# EAGLE design vectrex (EAGLE 6.6.0)
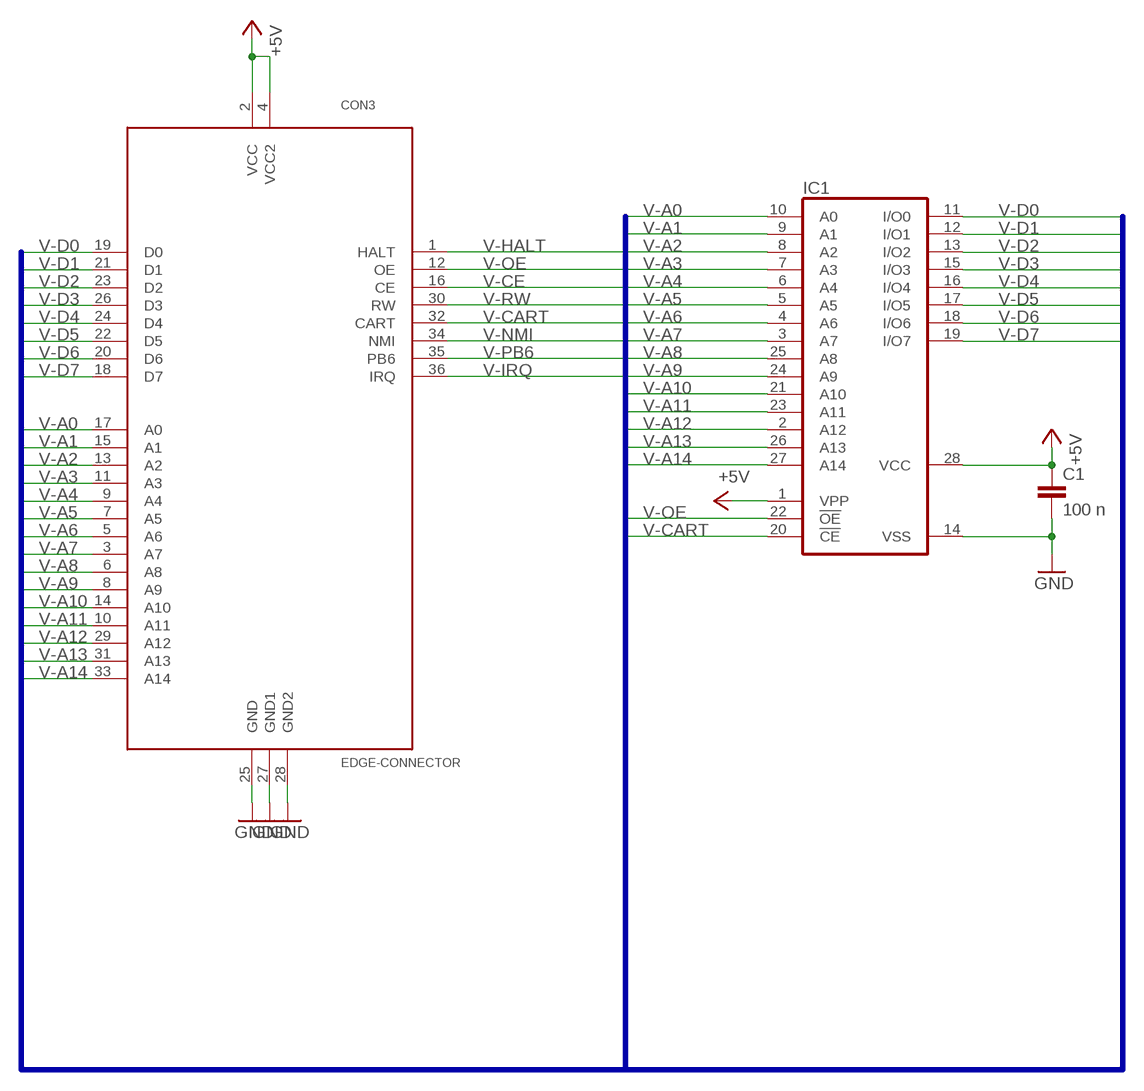
[diagram p0: schematic, sheet 1]

## Parts
C1  100 n  C-EU050-045X075  [C050-045X075]
CON3  EDGE-CONNECTOR  [EDGE-CONNECTOR]
IC1  27C256AG  [DIL28-6]

## Nets
+5V: C1.1 CON3.2(VCC) CON3.4(VCC2) IC1.1(VPP) IC1.28(VCC)
GND: C1.2 CON3.25(GND) CON3.27(GND1) CON3.28(GND2) IC1.14(VSS)
V-A0: CON3.17(A0) IC1.10(A0)
V-A1: CON3.15(A1) IC1.9(A1)
V-A2: CON3.13(A2) IC1.8(A2)
V-A3: CON3.11(A3) IC1.7(A3)
V-A4: CON3.9(A4) IC1.6(A4)
V-A5: CON3.7(A5) IC1.5(A5)
V-A6: CON3.5(A6) IC1.4(A6)
V-A7: CON3.3(A7) IC1.3(A7)
V-A8: CON3.6(A8) IC1.25(A8)
V-A9: CON3.8(A9) IC1.24(A9)
V-A10: CON3.14(A10) IC1.21(A10)
V-A11: CON3.10(A11) IC1.23(A11)
V-A12: CON3.29(A12) IC1.2(A12)
V-A13: CON3.31(A13) IC1.26(A13)
V-A14: CON3.33(A14) IC1.27(A14)
V-CART: CON3.32(CART) IC1.20(!CE)
V-CE: CON3.16(CE)
V-D0: CON3.19(D0) IC1.11(I/O0)
V-D1: CON3.21(D1) IC1.12(I/O1)
V-D2: CON3.23(D2) IC1.13(I/O2)
V-D3: CON3.26(D3) IC1.15(I/O3)
V-D4: CON3.24(D4) IC1.16(I/O4)
V-D5: CON3.22(D5) IC1.17(I/O5)
V-D6: CON3.20(D6) IC1.18(I/O6)
V-D7: CON3.18(D7) IC1.19(I/O7)
V-HALT: CON3.1(HALT)
V-IRQ: CON3.36(IRQ)
V-NMI: CON3.34(NMI)
V-OE: CON3.12(OE) IC1.22(!OE)
V-PB6: CON3.35(PB6)
V-RW: CON3.30(RW)

## Buses
V-DIR[0..6],V-A[0..14],V-D[0..7],V-HALT,V-OE,V-CE,V-RW,V-CART,V-NMI,V-PB6,V-IRQ

## Library data of the parts
C1 = rcl:C-EU: CAPACITOR, European symbol
CON3 = vectrex-cartridge:EDGE-CONNECTOR
IC1 = memory-hitachi:27C256AG: MEMORY; OC_FARNELL: unknown; OC_NEWARK: unknown

## Board
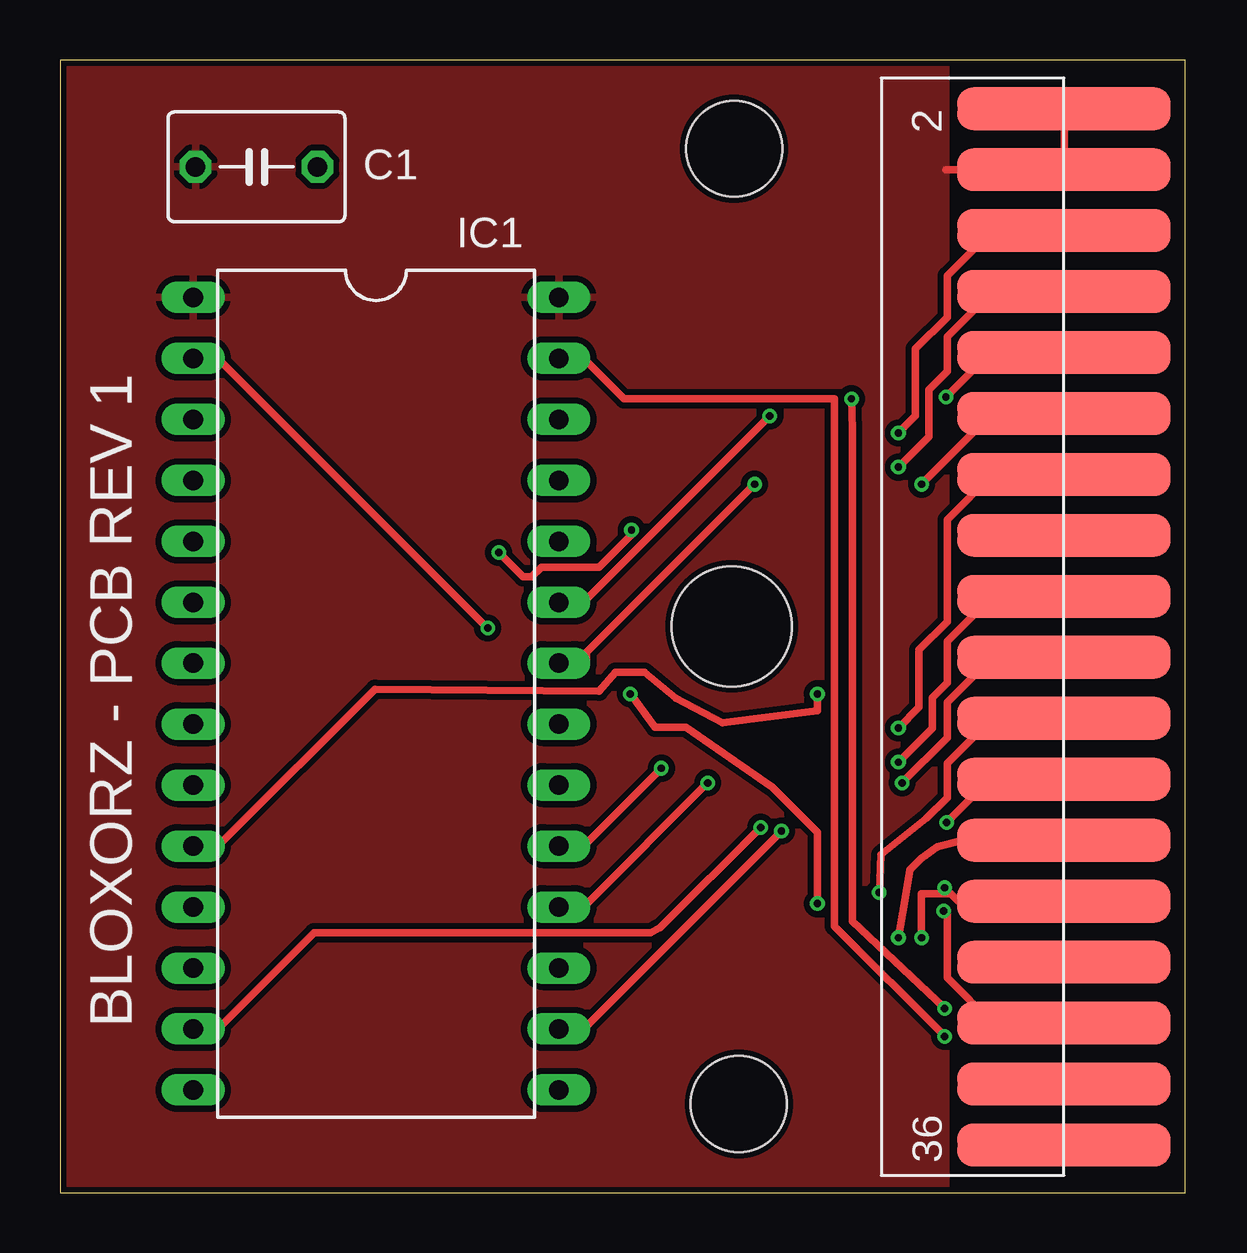
[diagram p1: board, top side]
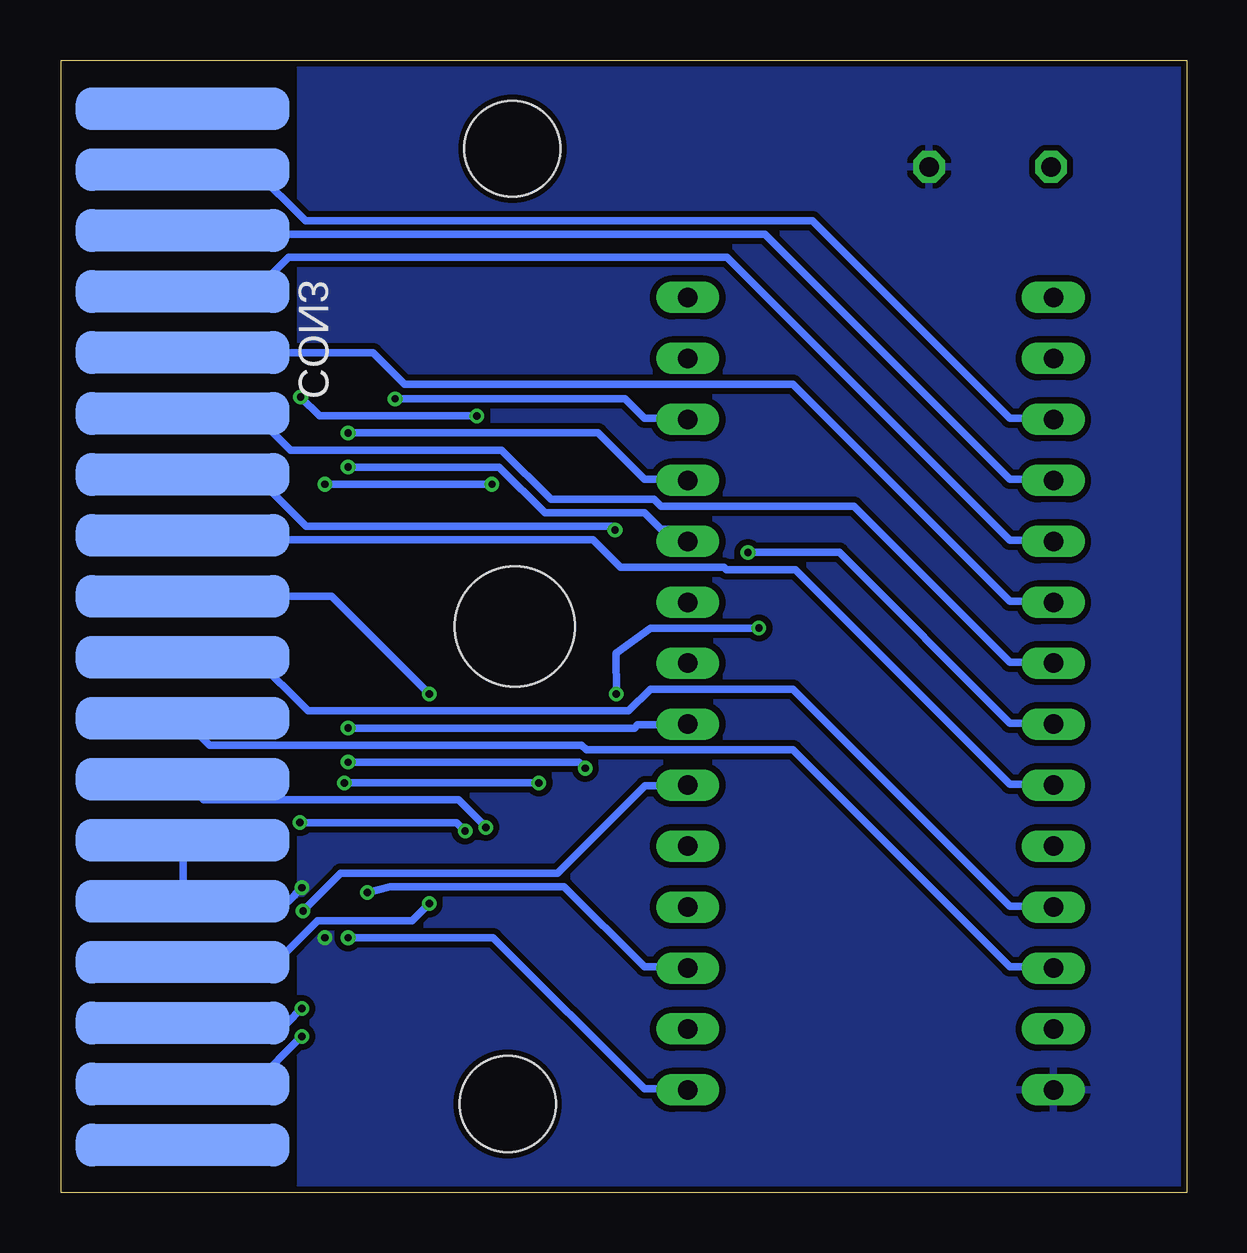
[diagram p2: board, bottom side, seen from below]

Size 46.9 x 47.2 mm. Coordinates in mm from the lower left corner, seen from the top.
Outline: 0,0 46.9,0 46.9,47.2 0,47.2 0,0
Copper layers (1*16): Top 0.035mm / dielectric 1.5mm / Bottom 0.035mm
Design rules "ITead_rule *": minimum track width 12mil, minimum drill 12mil, track to track 10mil, track to pad 10mil, pad to pad 10mil, via to via 10mil, smd to smd 0mil, copper to edge 10mil, drill to drill 10mil, minimum pad ring 10mil, minimum via ring 6mil, stop-mask expansion 2mil, vias tented up to drill 100mil, thermal gap 10mil
Holes 5 mm at 28,23.6
Holes 4 mm at 28.1,43.5 28.3,3.7

### Footprints (pad centres in the part's own frame; a part is rotated, then mirrored left to right if it is on the bottom)
C050-045X075 = drill 0.813 octagon: 1 -2.54,0; 2 2.54,0
EDGE-CONNECTOR = smd 1.778 x 8.89 bottom: 1 -25.4,0; 3 -22.86,0; 5 -20.32,0; 7 -17.78,0; 9 -15.24,0; 11 -12.7,0; 13 -10.16,0; 15 -7.62,0; 17 -5.08,0; 19 -2.54,0; 21 0,0; 23 2.54,0; 25 5.08,0; 27 7.62,0; 29 10.16,0; 31 12.7,0; 33 15.24,0; 35 17.78,0 | smd 1.778 x 8.89: 2 -25.4,0; 4 -22.86,0; 6 -20.32,0; 8 -17.78,0; 10 -15.24,0; 12 -12.7,0; 14 -10.16,0; 16 -7.62,0; 18 -5.08,0; 20 -2.54,0; 22 0,0; 24 2.54,0; 26 5.08,0; 28 7.62,0; 30 10.16,0; 32 12.7,0; 34 15.24,0; 36 17.78,0
DIL28-6 = drill 0.813 long: 1 -16.51,-7.62; 2 -13.97,-7.62; 3 -11.43,-7.62; 4 -8.89,-7.62; 5 -6.35,-7.62; 6 -3.81,-7.62; 7 -1.27,-7.62; 8 1.27,-7.62; 9 3.81,-7.62; 10 6.35,-7.62; 11 8.89,-7.62; 12 11.43,-7.62; 13 13.97,-7.62; 14 16.51,-7.62; 15 16.51,7.62; 16 13.97,7.62; 17 11.43,7.62; 18 8.89,7.62; 19 6.35,7.62; 20 3.81,7.62; 21 1.27,7.62; 22 -1.27,7.62; 23 -3.81,7.62; 24 -6.35,7.62; 25 -8.89,7.62; 26 -11.43,7.62; 27 -13.97,7.62; 28 -16.51,7.62

### Placement (x,y rotation side)
C1  8.19,42.75 0 top
CON3  41.85,19.77 270 top
IC1  13.17,20.8 270 top

### Tracks (layer width: path | path; a pad name or v marks a point on that pad's centre or on a via)
+5V
  Top 0.305: CON3.2 CON3.4 36.93,42.63
  pour Top: 0,0 0,47.2 36.93,47.2 36.93,-0.04
GND  (via drill 0.3)
  Top 0.305: CON3.28 37.44,12.15 37.13,12.46 36.88,12.46 | 36.88,12.46 35.91,12.46 v35.91,10.63 | v36.88,12.71 36.88,12.46
  Bottom 0.305: v36.88,12.71 37.44,12.15 CON3.28 41.83,12.28 41.83,14.69 CON3.25
  pour Bottom: 0,0 0,47.2 36.93,47.2 36.93,-0.04
V-A0  (via drill 0.3)
  Top 0.305: v31.57,20.79 31.57,20.08 27.61,19.58 25.68,20.6 24.37,21.7 23.16,21.69 22.46,20.89 13.13,20.99 6.7,14.57 6.7,14.46 5.56,14.46 IC1.10
  Bottom 0.305: v31.57,20.79 35.64,24.85 CON3.17
V-A1
  Bottom 0.305: IC1.9 5.56,17 5.59,17.03 7.36,17.03 16.3,25.97 19.17,25.97 19.28,26.07 23.59,26.07 24.74,27.21 41.65,27.21 41.83,27.39 CON3.15
V-A2  (via drill 0.3)
  Top 0.305: v18.29,26.68 19.3,25.67 19.66,25.67 20.06,26.07 22.48,26.07 23.82,27.42 v23.82,27.62
  Bottom 0.305: v18.29,26.68 14.48,26.68 7.36,19.57 5.59,19.57 5.56,19.54 IC1.8 | v23.82,27.62 23.98,27.77 36.7,27.77 38.86,29.93 CON3.13
V-A3
  Bottom 0.305: CON3.11 38.86,32.47 37.34,30.95 28.55,30.95 26.49,28.89 22.2,28.89 21.92,28.61 13.87,28.61 7.36,22.11 5.59,22.11 5.56,22.08 IC1.7
V-A4
  Bottom 0.305: CON3.9 33.91,35.01 32.59,33.69 16.41,33.69 7.36,24.65 5.59,24.65 5.56,24.62 IC1.6
V-A5
  Bottom 0.305: CON3.7 38.86,37.55 37.44,38.97 19.15,38.97 7.36,27.19 5.59,27.19 5.56,27.16 IC1.5
V-A6
  Bottom 0.305: IC1.4 5.56,29.7 5.59,29.73 7.36,29.73 17.58,39.94 41.68,39.94 41.83,40.09 CON3.5
V-A7
  Bottom 0.305: CON3.3 38.86,42.63 36.73,40.5 15.59,40.5 7.36,32.27 5.59,32.27 5.56,32.24 IC1.3
V-A8  (via drill 0.3)
  Top 0.305: v34.95,31.66 35.66,32.37 35.66,35.16 36.98,36.48 36.98,38.21 38.86,40.09 CON3.6
  Bottom 0.305: v34.95,31.66 24.53,31.66 22.6,29.73 20.83,29.73 20.8,29.7 IC1.25
V-A9  (via drill 0.3)
  Top 0.305: v34.95,30.24 36.22,31.51 36.22,33.46 36.98,34.22 36.98,35.67 38.86,37.55 CON3.8
  Bottom 0.305: v34.95,30.24 28.65,30.24 26.75,28.33 22.6,28.33 21.92,27.65 21.28,27.65 20.8,27.16 IC1.24
V-A10  (via drill 0.3)
  Top 0.305: v34.95,19.37 35.81,20.23 35.81,22.62 36.98,23.79 36.98,28.05 38.86,29.93 CON3.14
  Bottom 0.305: v34.95,19.37 23.01,19.37 22.88,19.49 20.83,19.49 20.8,19.52 IC1.21
V-A11  (via drill 0.3)
  Top 0.305: v29.59,32.37 21.94,24.72 21.94,24.62 20.8,24.62 IC1.23 | v36.93,33.16 38.78,35.01 CON3.10
  Bottom 0.305: v29.59,32.37 36.14,32.37 v36.93,33.16
V-A12  (via drill 0.3)
  Top 0.305: v17.83,23.53 6.7,34.66 6.7,34.76 5.56,34.76 IC1.2 | v23.77,20.79 24.01,20.49 24.8,19.4 26.1,19.4 29.7,16.9 31.57,15.03 v31.57,12.05
  Bottom 0.305: v17.83,23.53 22.35,23.53 23.79,22.49 v23.77,20.79 | v31.57,12.05 32.28,11.34 36.22,11.34 37.95,9.61 CON3.29
V-A13  (via drill 0.3)
  Top 0.305: v32.99,33.08 33.04,31.84 33.04,11.32 v36.88,7.68
  Bottom 0.305: v32.99,33.08 23.42,33.08 22.6,32.27 20.83,32.27 20.8,32.24 IC1.26 | v36.88,7.68 37.49,7.07 CON3.31
V-A14  (via drill 0.3)
  Top 0.305: v36.88,6.51 32.28,11.11 32.28,33.08 23.52,33.08 21.94,34.66 21.94,34.76 20.8,34.76 IC1.27
  Bottom 0.305: v36.88,6.51 38.86,4.53 CON3.33
V-CART  (via drill 0.3)
  Top 0.305: v36.83,11.75 36.98,11.59 36.98,8.95 38.86,7.07 CON3.32
  Bottom 0.305: v36.83,11.75 35.25,13.32 26.21,13.32 22.58,16.95 20.83,16.95 20.8,16.98 IC1.20
V-D0
  Bottom 0.305: CON3.19 38.86,22.31 36.62,20.08 23.27,20.08 22.35,20.99 16.41,20.99 7.36,11.95 5.59,11.95 5.56,11.92 IC1.11
V-D1
  Bottom 0.305: IC1.12 5.56,9.38 5.59,9.41 7.36,9.41 16.41,18.45 25.02,18.45 25.22,18.65 40.72,18.65 41.83,19.77 CON3.21
V-D2  (via drill 0.3)
  Top 0.305: v29.21,15.23 25.02,11.03 24.62,10.83 10.59,10.83 6.7,6.95 6.7,6.84 5.56,6.84 IC1.13
  Bottom 0.305: v29.21,15.23 30.35,16.37 40.97,16.37 41.83,17.23 CON3.23
V-D3  (via drill 0.3)
  Top 0.305: v34.95,10.63 35.22,12.2 35.42,13.46 35.88,13.92 36.58,14.43 37.64,14.69 CON3.26
  Bottom 0.305: v34.95,10.63 28.9,10.63 22.6,4.33 20.83,4.33 20.8,4.3 IC1.15
V-D4  (via drill 0.3)
  Top 0.305: v30.07,15.07 21.94,6.95 21.94,6.84 20.8,6.84 IC1.16 | v36.95,15.43 38.76,17.23 CON3.24
  Bottom 0.305: v30.07,15.07 30.43,15.43 v36.95,15.43
V-D5  (via drill 0.3)
  Top 0.305: v34.15,12.51 34.22,14.08 36.12,15.61 36.98,16.47 36.98,17.89 38.86,19.77 CON3.22
  Bottom 0.305: v34.15,12.51 33.2,12.76 25.96,12.76 22.6,9.41 20.83,9.41 20.8,9.38 IC1.17
V-D6  (via drill 0.3)
  Top 0.305: v27,17.08 21.94,12.03 21.94,11.92 20.8,11.92 IC1.18 | v35.1,17.08 36.98,18.96 36.98,20.43 38.86,22.31 CON3.20
  Bottom 0.305: v35.1,17.08 v27,17.08
V-D7  (via drill 0.3)
  Top 0.305: v25.07,17.69 21.94,14.57 21.94,14.46 20.8,14.46 IC1.19 | v34.95,17.94 36.37,19.37 36.37,20.64 36.98,21.25 36.98,22.97 38.86,24.85 CON3.18
  Bottom 0.305: v25.07,17.69 25.32,17.94 v34.95,17.94
V-OE  (via drill 0.3)
  Top 0.305: v28.95,29.53 21.94,22.52 21.94,22.08 20.8,22.08 IC1.22 | v35.91,29.53 38.86,32.47 CON3.12
  Bottom 0.305: v35.91,29.53 v28.95,29.53

### Text on the board
tNames: BLOXORZ - PCB REV 1